# Altium schematic sheet Sitara_IO_Bank_6.SchDoc
size A3; SheetNumber: 9; SheetTotal: 11
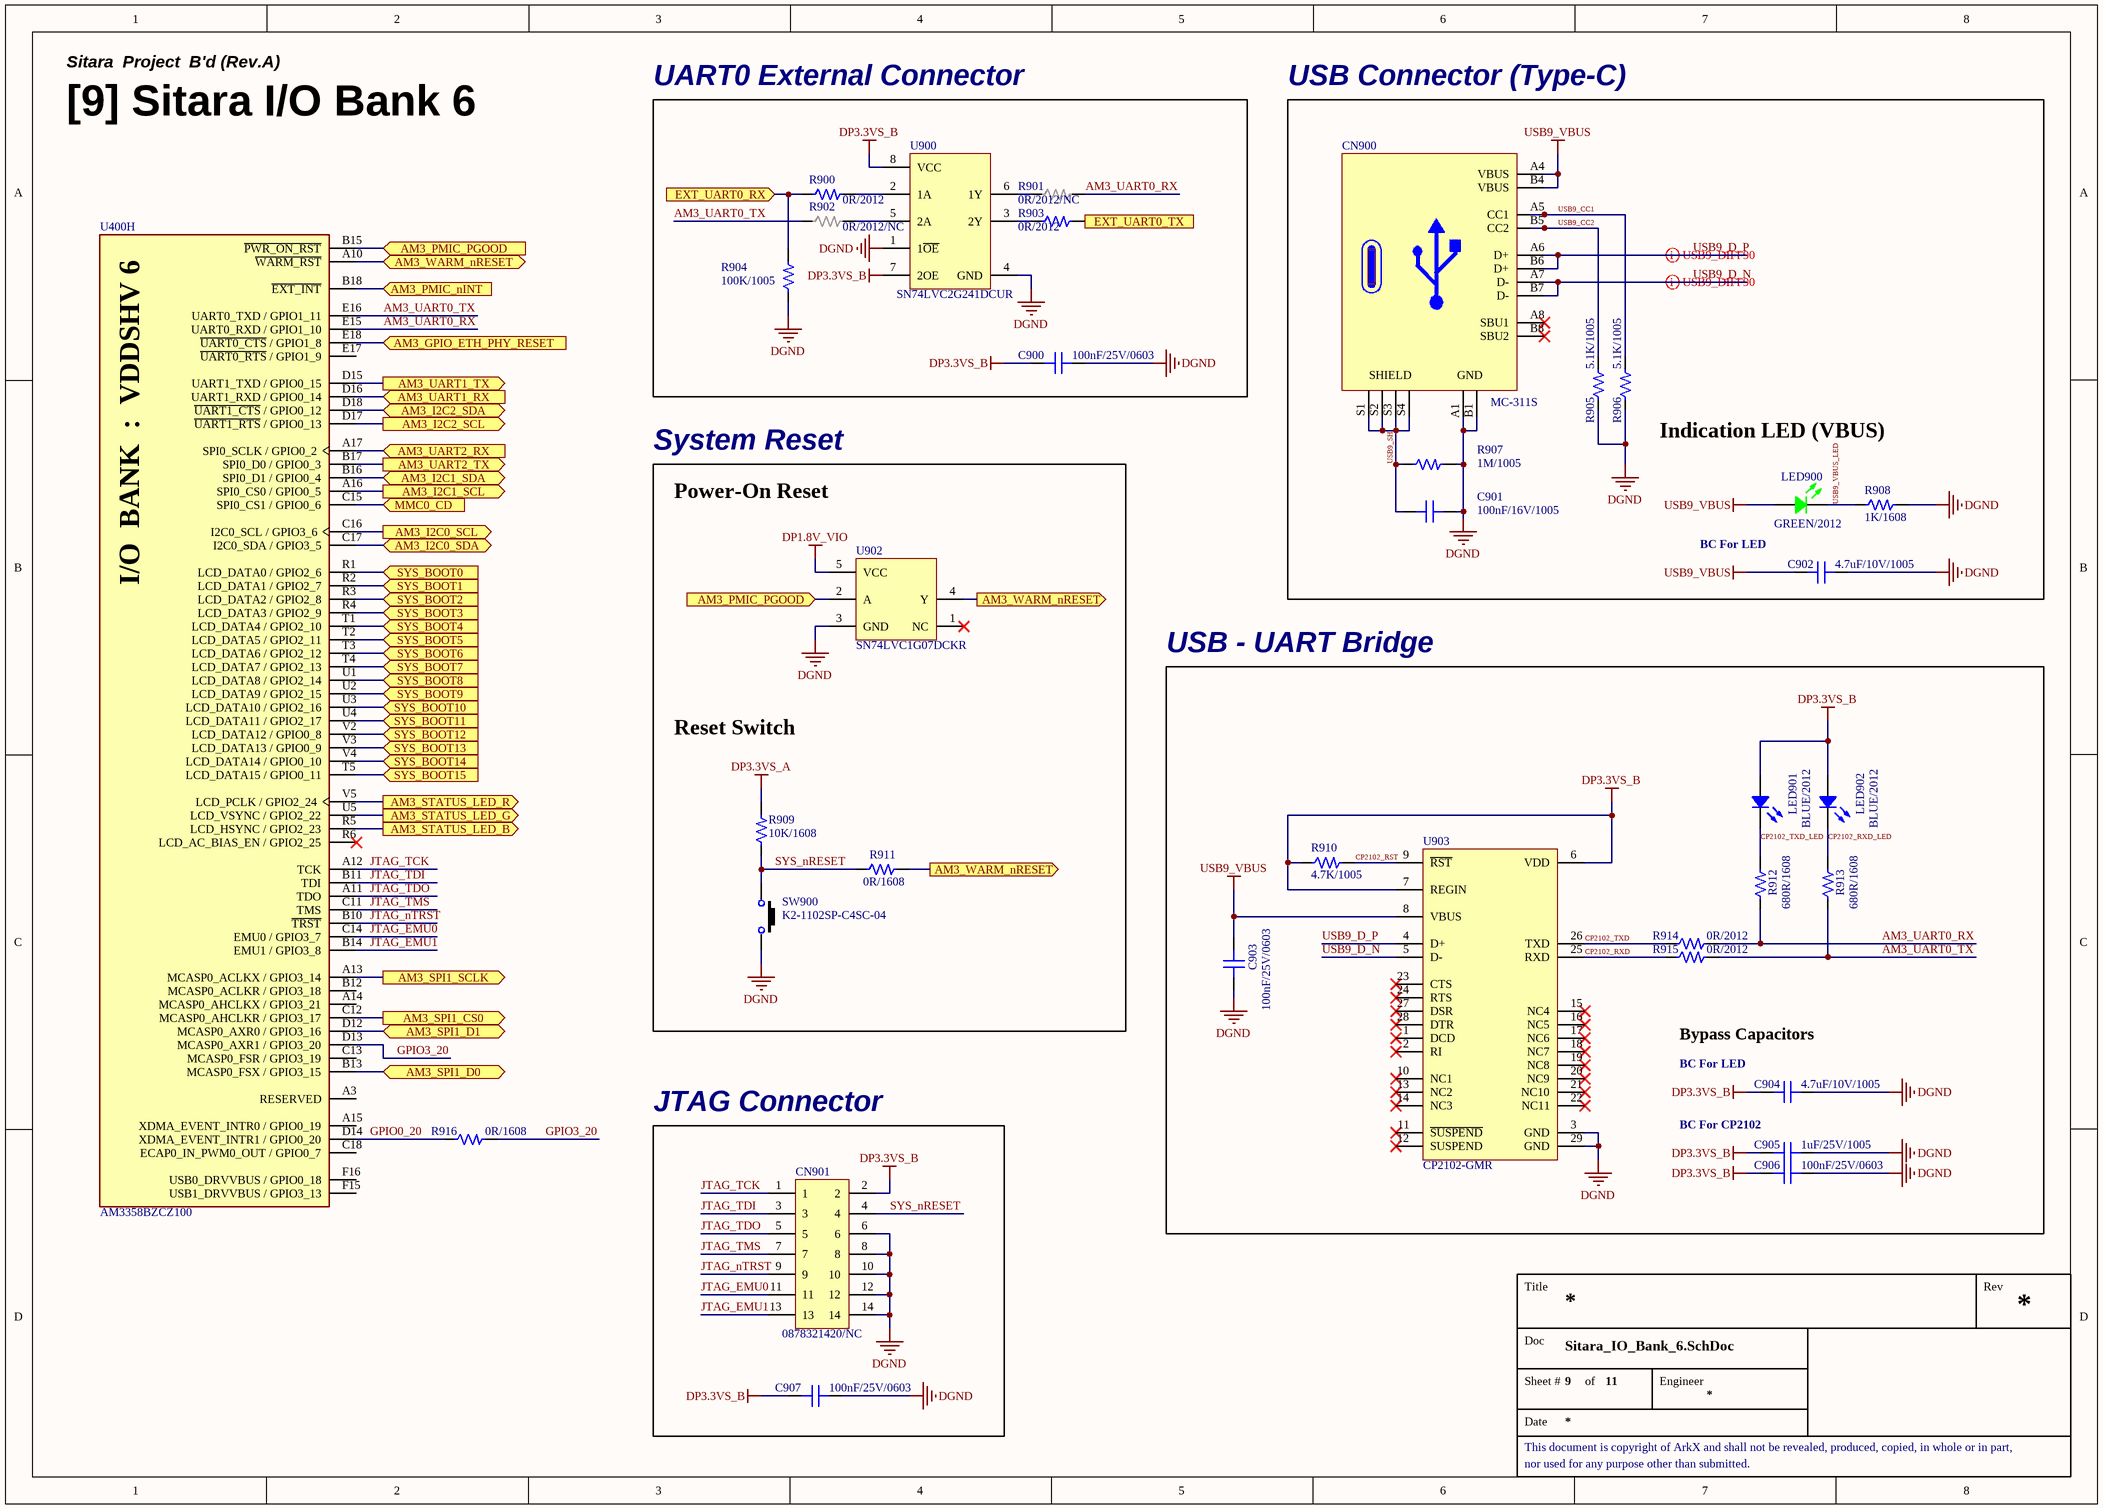
[diagram p0: Sitara_IO_Bank_6.SchDoc]

## Parts
C900  100nF/25V/0603  [CAP 0603 (0201_INCH)]
C901  100nF/16V/1005  [CAP 1005 (0402_INCH)]
C902  4.7uF/10V/1005  [CAP 1005 (0402_INCH)]
C903  100nF/25V/0603  [CAP 0603 (0201_INCH)]
C904  4.7uF/10V/1005  [CAP 1005 (0402_INCH)]
C905  1uF/25V/1005  [CAP 1005 (0402_INCH)]
C906  100nF/25V/0603  [CAP 0603 (0201_INCH)]
C907  100nF/25V/0603  [CAP 0603 (0201_INCH)]
CN900  MC-311S  [CON USB-Type-C (16P)]
CN901  0878321420/NC  [CON_NC_BOX_HEADER_DUAL_2x7PIN(2.00MM) (0878321420)]
LED900  GREEN/2012  [LED MHT170RGBCT (GREEN)]
LED901  BLUE/2012  [LED MHT170RGBCT (BLUE)]
LED902  BLUE/2012  [LED MHT170RGBCT (BLUE)]
R900  0R/2012  [RES 2012 (0805_inch)]
R901  0R/2012/NC  [RES 2012 (0805_INCH)/NC]
R902  0R/2012/NC  [RES 2012 (0805_INCH)/NC]
R903  0R/2012  [RES 2012 (0805_inch)]
R904  100K/1005  [RES 1005 (0402_inch)]
R905  5.1K/1005  [RES 1005 (0402_inch)]
R906  5.1K/1005  [RES 1005 (0402_inch)]
R907  1M/1005  [RES 1005 (0402_inch)]
R908  1K/1608  [RES 1608 (0603_inch)]
R909  10K/1608  [RES 1608 (0603_inch)]
R910  4.7K/1005  [RES 1005 (0402_inch)]
R911  0R/1608  [RES 1608 (0603_inch)]
R912  680R/1608  [RES 1608 (0603_inch)]
R913  680R/1608  [RES 1608 (0603_inch)]
R914  0R/2012  [RES 2012 (0805_inch)]
R915  0R/2012  [RES 2012 (0805_inch)]
R916  0R/1608  [RES 1608 (0603_inch)]
SW900  K2-1102SP-C4SC-04  [SW K2-1102SP-C4SC-04]
U400  AM3358BZCZ100  [IC_SOC_AM3358BZCZ100]  (part H of 8)
U900  SN74LVC2G241DCUR  [IC_VSSOP-8]
U902  SN74LVC1G07DCKR  [IC_SC-70-5]
U903  CP2102-GMR  [QFN-28 (5x5mm)]

## Blocks framed on the sheet
UART0 External Connector: C900 R900-R904 U900
USB Connector (Type-C): C901 C902 CN900 LED900 R905-R908
System Reset: R909 R911 SW900 U902
USB - UART Bridge: C903-C906 LED901 LED902 R910 R912-R915 U903
JTAG Connector: C907 CN901

## Ports
AM3_GPIO_ETH_PHY_RESET (in), AM3_I2C0_SCL (out), AM3_I2C0_SDA (bidir), AM3_I2C1_SCL (out), AM3_I2C1_SDA (bidir), AM3_I2C2_SCL (out), AM3_I2C2_SDA (bidir), AM3_PMIC_nINT (in), AM3_PMIC_PGOOD (in), AM3_SPI1_CS0 (out), AM3_SPI1_D0 (bidir), AM3_SPI1_D1 (bidir), AM3_SPI1_SCLK (out), AM3_STATUS_LED_B (out), AM3_STATUS_LED_G (out), AM3_STATUS_LED_R (out), AM3_UART1_RX (in), AM3_UART1_TX (out), AM3_UART2_RX (in), AM3_UART2_TX (out), AM3_WARM_nRESET (bidir), AM3_WARM_nRESET (out), EXT_UART0_RX (in), EXT_UART0_TX (out), MMC0_CD (in), SYS_BOOT0 (in), SYS_BOOT1 (in), SYS_BOOT2 (in), SYS_BOOT3 (in), SYS_BOOT4 (in), SYS_BOOT5 (in), SYS_BOOT6 (in), SYS_BOOT7 (in), SYS_BOOT8 (in), SYS_BOOT9 (in), SYS_BOOT10 (in), SYS_BOOT11 (in), SYS_BOOT12 (in), SYS_BOOT13 (in), SYS_BOOT14 (in), SYS_BOOT15 (in)

## Nets
DGND: C900.1 C901.1 C902.1 C903.2 C904.1 C905.2 C906.1 C907.1 CN900.A1(GND) CN900.B1(GND) CN901.6 CN901.8 CN901.10 CN901.12 CN901.14 R904.1 R905.1 R906.1 R907.2 R908.2 SW900.3 U900.1(1~{OE}) U900.4(GND) U902.3(GND) U903.3(GND) U903.29(GND)
DP1.8V_VIO: U902.5(VCC)
DP3.3VS_A: R909.2
DP3.3VS_B: C900.2 C904.2 C905.1 C906.2 C907.2 CN901.2 LED901.4(Common_Anode) LED902.4(Common_Anode) R910.1 U900.7(2OE) U900.8(VCC) U903.6(VDD) U903.7(REGIN)
USB9_VBUS: C902.2 C903.1 CN900.A4(VBUS) CN900.B4(VBUS) LED900.4(Common_Anode) U903.8(VBUS)
AM3_GPIO_ETH_PHY_RESET: U400.E18(~{UART0_CTS}_/_GPIO1_8) ; port AM3_GPIO_ETH_PHY_RESET
AM3_I2C0_SCL: U400.C16(I2C0_SCL_/_GPIO3_6) ; port AM3_I2C0_SCL
AM3_I2C0_SDA: U400.C17(I2C0_SDA_/_GPIO3_5) ; port AM3_I2C0_SDA
AM3_I2C1_SCL: U400.A16(SPI0_CS0_/_GPIO0_5) ; port AM3_I2C1_SCL
AM3_I2C1_SDA: U400.B16(SPI0_D1_/_GPIO0_4) ; port AM3_I2C1_SDA
AM3_I2C2_SCL: U400.D17(~{UART1_RTS}_/_GPIO0_13) ; port AM3_I2C2_SCL
AM3_I2C2_SDA: U400.D18(~{UART1_CTS}_/_GPIO0_12) ; port AM3_I2C2_SDA
AM3_PMIC_nINT: U400.B18(~{EXT_INT}) ; port AM3_PMIC_nINT
AM3_PMIC_PGOOD: U400.B15(~{PWR_ON_RST}) U902.2(A) ; port AM3_PMIC_PGOOD
AM3_SPI1_CS0: U400.C12(MCASP0_AHCLKR_/_GPIO3_17) ; port AM3_SPI1_CS0
AM3_SPI1_D0: U400.B13(MCASP0_FSX_/_GPIO3_15) ; port AM3_SPI1_D0
AM3_SPI1_D1: U400.D12(MCASP0_AXR0_/_GPIO3_16) ; port AM3_SPI1_D1
AM3_SPI1_SCLK: U400.A13(MCASP0_ACLKX_/_GPIO3_14) ; port AM3_SPI1_SCLK
AM3_STATUS_LED_B: U400.R5(LCD_HSYNC_/_GPIO2_23) ; port AM3_STATUS_LED_B
AM3_STATUS_LED_G: U400.U5(LCD_VSYNC_/_GPIO2_22) ; port AM3_STATUS_LED_G
AM3_STATUS_LED_R: U400.V5(LCD_PCLK_/_GPIO2_24) ; port AM3_STATUS_LED_R
AM3_UART0_RX: R901.2 R912.1 R914.2 U400.E15(UART0_RXD_/_GPIO1_10)
AM3_UART0_TX: R902.1 R913.1 R915.2 U400.E16(UART0_TXD_/_GPIO1_11)
AM3_UART1_RX: U400.D16(UART1_RXD_/_GPIO0_14) ; port AM3_UART1_RX
AM3_UART1_TX: U400.D15(UART1_TXD_/_GPIO0_15) ; port AM3_UART1_TX
AM3_UART2_RX: U400.A17(SPI0_SCLK_/_GPIO0_2) ; port AM3_UART2_RX
AM3_UART2_TX: U400.B17(SPI0_D0_/_GPIO0_3) ; port AM3_UART2_TX
AM3_WARM_nRESET: R911.2 U400.A10(~{WARM_RST}) U902.4(Y) ; port AM3_WARM_nRESET
CP2102_RST: R910.2 U903.9(~{RST})
CP2102_RXD: R915.1 U903.25(RXD)
CP2102_RXD_LED: LED902.3(BLUE) R913.2
CP2102_TXD: R914.1 U903.26(TXD)
CP2102_TXD_LED: LED901.3(BLUE) R912.2
EXT_UART0_RX: R900.1 R904.2 ; port EXT_UART0_RX
EXT_UART0_TX: R903.2 ; port EXT_UART0_TX
GPIO0_20: R916.1 U400.D14(XDMA_EVENT_INTR1_/_GPIO0_20)
GPIO3_20: R916.2 U400.D13(MCASP0_AXR1_/_GPIO3_20)
JTAG_EMU0: CN901.11 U400.C14(EMU0_/_GPIO3_7)
JTAG_EMU1: CN901.13 U400.B14(EMU1_/_GPIO3_8)
JTAG_nTRST: CN901.9 U400.B10(~{TRST})
JTAG_TCK: CN901.1 U400.A12(TCK)
JTAG_TDI: CN901.3 U400.B11(TDI)
JTAG_TDO: CN901.5 U400.A11(TDO)
JTAG_TMS: CN901.7 U400.C11(TMS)
MMC0_CD: U400.C15(SPI0_CS1_/_GPIO0_6) ; port MMC0_CD
SYS_BOOT0: U400.R1(LCD_DATA0_/_GPIO2_6) ; port SYS_BOOT0
SYS_BOOT1: U400.R2(LCD_DATA1_/_GPIO2_7) ; port SYS_BOOT1
SYS_BOOT2: U400.R3(LCD_DATA2_/_GPIO2_8) ; port SYS_BOOT2
SYS_BOOT3: U400.R4(LCD_DATA3_/_GPIO2_9) ; port SYS_BOOT3
SYS_BOOT4: U400.T1(LCD_DATA4_/_GPIO2_10) ; port SYS_BOOT4
SYS_BOOT5: U400.T2(LCD_DATA5_/_GPIO2_11) ; port SYS_BOOT5
SYS_BOOT6: U400.T3(LCD_DATA6_/_GPIO2_12) ; port SYS_BOOT6
SYS_BOOT7: U400.T4(LCD_DATA7_/_GPIO2_13) ; port SYS_BOOT7
SYS_BOOT8: U400.U1(LCD_DATA8_/_GPIO2_14) ; port SYS_BOOT8
SYS_BOOT9: U400.U2(LCD_DATA9_/_GPIO2_15) ; port SYS_BOOT9
SYS_BOOT10: U400.U3(LCD_DATA10_/_GPIO2_16) ; port SYS_BOOT10
SYS_BOOT11: U400.U4(LCD_DATA11_/_GPIO2_17) ; port SYS_BOOT11
SYS_BOOT12: U400.V2(LCD_DATA12_/_GPIO0_8) ; port SYS_BOOT12
SYS_BOOT13: U400.V3(LCD_DATA13_/_GPIO0_9) ; port SYS_BOOT13
SYS_BOOT14: U400.V4(LCD_DATA14_/_GPIO0_10) ; port SYS_BOOT14
SYS_BOOT15: U400.T5(LCD_DATA15_/_GPIO0_11) ; port SYS_BOOT15
SYS_nRESET: CN901.4 R909.1 R911.1 SW900.1
USB9_CC1: CN900.A5(CC1) R906.2
USB9_CC2: CN900.B5(CC2) R905.2
USB9_D_N: CN900.A7(D-) CN900.B7(D-) U903.5(D-)
USB9_D_P: CN900.A6(D+) CN900.B6(D+) U903.4(D+)
USB9_SH: C901.2 CN900.S1(SHIELD) CN900.S2(SHIELD) CN900.S3(SHIELD) CN900.S4(SHIELD) R907.1
USB9_VBUS_LED: LED900.2(GREEN) R908.1
NetR900_2: R900.2 U900.2(1A)
NetR901_1: R901.1 U900.6(1Y)
NetR902_2: R902.2 U900.5(2A)
NetR903_1: R903.1 U900.3(2Y)

Not connected (* = marked no-connect by the designer): CN900 A8(SBU1)* B8(SBU2)*; U400 A3(RESERVED) A14(MCASP0_AHCLKX_/_GPIO3_21) A15(XDMA_EVENT_INTR0_/_GPIO0_19) B12(MCASP0_ACLKR_/_GPIO3_18) C13(MCASP0_FSR_/_GPIO3_19) C18(ECAP0_IN_PWM0_OUT_/_GPIO0_7) E17(~{UART0_RTS}_/_GPIO1_9) F15(USB1_DRVVBUS_/_GPIO3_13) F16(USB0_DRVVBUS_/_GPIO0_18) R6(LCD_AC_BIAS_EN_/_GPIO2_25)*; U902 1(NC)*; U903 1(DCD)* 2(RI)* 10(NC1)* 11(~{SUSPEND})* 12(SUSPEND)* 13(NC2)* 14(NC3)* 15(NC4)* 16(NC5)* 17(NC6)* 18(NC7)* 19(NC8)* 20(NC9)* 21(NC10)* 22(NC11)* 23(CTS)* 24(RTS)* 27(DSR)* 28(DTR)*

## Layout directives
differential pair; differential pair class USB9_DIFF90: USB9_D_N, USB9_D_P

## Notes on the sheet
- Sitara  Project  B'd (Rev.A)
- [9] Sitara I/O Bank 6
- Indication LED (VBUS)
- Power-On Reset
- BC For LED
- Reset Switch
- Bypass Capacitors
- (near C904) BC For LED
- BC For CP2102
- Title
- Rev
- Doc
- Sheet #
- of
- Engineer
- This document is copyright of ArkX and shall not be revealed, produced, copied, in whole or in part,
- Date
- nor used for any purpose other than submitted.
- (in symbol IC_SOC_AM3358BZCZ100, part H) I/O  BANK  :  VDDSHV 6

## Library data of the parts
C900 C903 C906 C907 = CAP_100nF/25V/0603: Ceramic CAP_100nF/25V/0603; JLCPCB Part Type: Extended Part; LCSC Part #: C181047
C901 = CAP_100nF/16V/1005: Ceramic CAP_100nF/16V/1005; LCSC Part #: C1525; JLCPCB Part Type: Basic Part
C902 C904 = CAP_4.7uF/10V/1005: 10V 4.7uF X5R ±20% 0402  Multilayer Ceramic Capacitors MLCC - SMD/SMT ROHS; JLCPCB Part Type: Basic Part; LCSC Part #: C23733
C905 = CAP_1uF/25V/1005: Ceramic CAP_1uF/25V/1005; LCSC Part #: C52923; JLCPCB Part Type: Basic Part
CN900 = CON_USB-Type-C: USB 2.0 5A 1 Surface Mount 16 Female -35℃~+75℃ Type-C SMD  USB Connectors ROHS; LCSC Part #: C2977718; JLCPCB Part Type: Extended Part
CN901 = CON_NC_BOX_HEADER_DUAL_2x7PIN(2.00MM)_1: CONN HEADER SMD 14POS 2MM
LED900 = LED_MHT170RGBCT(GREEN): Colorless transparence -30℃~+85℃ Positive post Common anode RGB 120° 0805  Light Emitting Diodes (LED) ROHS; LCSC Part #: C2962094; JLCPCB Part Type: Extended Part
LED901 LED902 = LED_MHT170RGBCT(BLUE): Colorless transparence -30℃~+85℃ Positive post Common anode RGB 120° 0805  Light Emitting Diodes (LED) ROHS; LCSC Part #: C2962094; JLCPCB Part Type: Extended Part
R900 R903 R914 R915 = RES_0R/2012/0.125W: Value: 0R; Power Rating: 0.125W; Precision: 1%; Size: 2012; LCSC Part #: C17477; JLCPCB Part Type: Basic Part
R901 R902 = RES_NC_0R/2012/0.125W: 0R/2012/0.125W/NC; Value: 0R; Power Rating: 0.1W; Precision: 1%; Size: 1608
R904 = RES_100K/1005/62.5mW: Value: 100K; Power Rating: 62.5mW; Precision: 1%; Size: 1005; LCSC Part #: C25741; JLCPCB Part Type: Basic Part
R905 R906 = RES_5.1K/1005/62.5mW: Value: 5.1K; Power Rating: 62.5mW; Precision: 1%; Size: 1005; LCSC Part #: C25905; JLCPCB Part Type: Basic Part
R907 = RES_1M/1005/62.5mW: Value: 1M; Power Rating: 62.5mW; Precision: 1%; Size: 1005; LCSC Part #: C26083; JLCPCB Part Type: Basic Part
R908 = RES_1K/1608/0.1W: Value: 1K; Power Rating: 0.1W; Precision: 1%; Size: 1608; LCSC Part #: C21190; JLCPCB Part Type: Basic Part
R909 = RES_10K/1608/0.1W: Value: 10K; Power Rating: 0.1W; Precision: 1%; Size: 1608; LCSC Part #: C25804; JLCPCB Part Type: Basic Part
R910 = RES_4.7K/1005/62.5mW: Value: 4.7K; Power Rating: 62.5mW; Precision: 1%; Size: 1005; LCSC Part #: C25900; JLCPCB Part Type: Basic Part
R911 R916 = RES_0R/1608/0.1W: Value: 0R; Power Rating: 0.1W; Precision: 1%; Size: 1608; LCSC Part #: C21189; JLCPCB Part Type: Basic Part
R912 R913 = RES_680R/1608/0.1W: Value: 680R; Power Rating: 0.1W; Precision: 1%; Size: 1608; LCSC Part #: C23228; JLCPCB Part Type: Basic Part
SW900 = SW_K2-1102SP-C4SC-04(2P): -25℃~+85℃ 6mm 5mm Round Button 50mA Brick nogging 6mm SPST 100MΩ 100000 250gf@±30gf 12V SMD  Tactile Switches ROHS; LCSC Part #: C127509; JLCPCB Part Type: Extended Part
U400 = IC_SOC_AM3358BZCZ100: ARM® Cortex®-A8 Microprocessor IC Sitara™ 1 Core, 32-Bit 1.0GHz 324-NFBGA (15x15); LCSC Part #: C73932; JLCPCB Part Type: Extended Part
U900 = IC_BUF_SN74LVC2G241DCUR: Buffer, Non-Inverting 2 Element 1 Bit per Element 3-State Output 8-VSSOP; LCSC Part #: C10430; JLCPCB Part Type: Extended Part
U902 = IC_BUF_SN74LVC1G07DCKR: Buffer, Non-Inverting 1 Element 1 Bit per Element Open Drain Output SC-70-5; LCSC Part #: C7830; JLCPCB Part Type: Extended Part
U903 = IC_USB_CP2102: Transceiver 1Mbps USB 1/1 QFN-28_5x5x05P  USB ICs ROHS; LCSC Part #: C6568; JLCPCB Part Type: Basic Part